# Altium project RocketPayloadV1.PrjPcb (part 1 of 2)
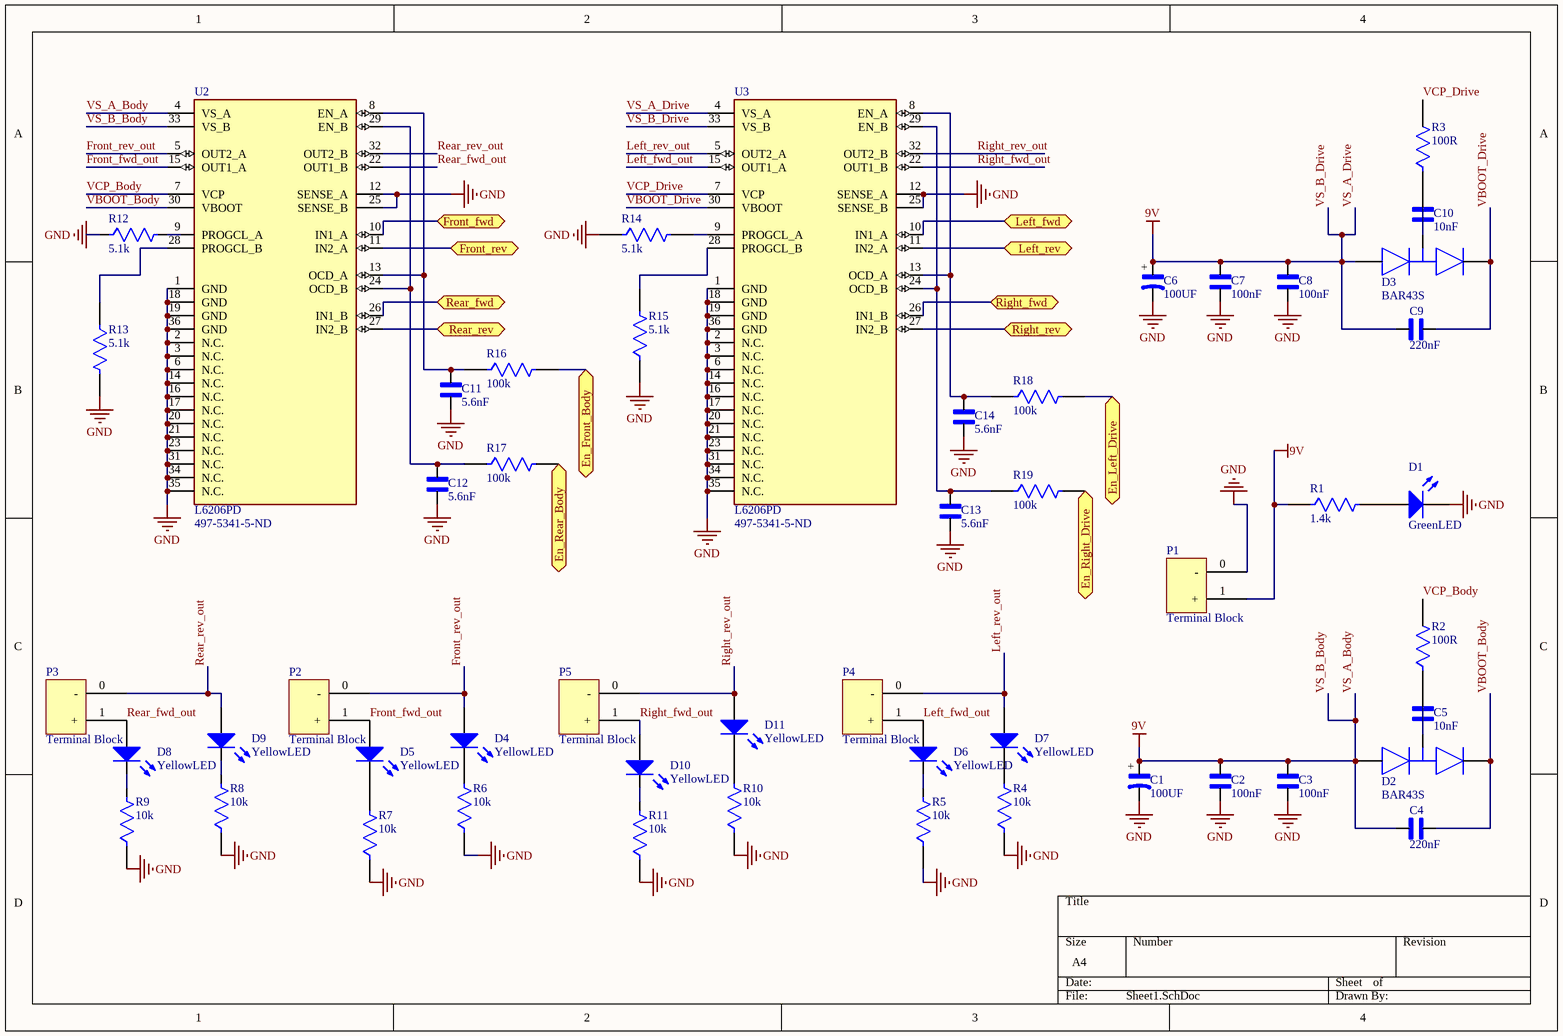
[diagram p0: Sheet1.SchDoc]
2 sheets, 77 parts. Net scope: flat (ports and power ports of the same name join across sheets).
Board file: PCB1.PcbDoc
Sheets:
  Sheet1.SchDoc
  Sheet2.SchDoc

## Sheet Sheet1.SchDoc
size A4

### Parts
C1  100UF  [100UF]
C2  100nF  [0402 Capacitor]
C3  100nF  [0402 Capacitor]
C4  220nF  [0805 Capacitor]
C5  10nF  [0402 Capacitor]
C6  100UF  [100UF]
C7  100nF  [0402 Capacitor]
C8  100nF  [0402 Capacitor]
C9  220nF  [0805 Capacitor]
C10  10nF  [0402 Capacitor]
C11  5.6nF  [0402 Capacitor]
C12  5.6nF  [0402 Capacitor]
C13  5.6nF  [0402 Capacitor]
C14  5.6nF  [0402 Capacitor]
D1  GreenLED  [LED]
D2  BAR43S  [Double Diode]
D3  BAR43S  [Double Diode]
D4  YellowLED  [LED]
D5  YellowLED  [LED]
D6  YellowLED  [LED]
D7  YellowLED  [LED]
D8  YellowLED  [LED]
D9  YellowLED  [LED]
D10  YellowLED  [LED]
D11  YellowLED  [LED]
P1  Terminal Block  [PHOENIX_1935161]
P2  Terminal Block  [PHOENIX_1935161]
P3  Terminal Block  [PHOENIX_1935161]
P4  Terminal Block  [PHOENIX_1935161]
P5  Terminal Block  [PHOENIX_1935161]
R1  1.4k  [0402 Resistor]
R2  100R  [0805 Resistor]
R3  100R  [0805 Resistor]
R4  10k  [0402 Resistor]
R5  10k  [0402 Resistor]
R6  10k  [0402 Resistor]
R7  10k  [0402 Resistor]
R8  10k  [0402 Resistor]
R9  10k  [0402 Resistor]
R10  10k  [0402 Resistor]
R11  10k  [0402 Resistor]
R12  5.1k  [0402 Resistor]
R13  5.1k  [0402 Resistor]
R14  5.1k  [0402 Resistor]
R15  5.1k  [0402 Resistor]
R16  100k  [0805 Resistor]
R17  100k  [0805 Resistor]
R18  100k  [0805 Resistor]
R19  100k  [0805 Resistor]
U2  L6206PD  Supplier Part Number 1: 497-5341-5-ND  [L6206PD]
U3  L6206PD  Supplier Part Number 1: 497-5341-5-ND  [L6206PD]

### Ports
En_Front_Body (bidir), En_Left_Drive (bidir), En_Rear_Body (bidir), En_Right_Drive (bidir), Front_fwd (bidir), Front_rev (bidir), Left_fwd (bidir), Left_rev (bidir), Rear_fwd (bidir), Rear_rev (bidir), Right_fwd (bidir), Right_rev (bidir)

### Nets
GND: C1.1 C2.1 C3.1 C6.1 C7.1 C8.1 C11.1 C12.1 C13.1 C14.1 D1.2(K) P1.0(-) R4.1 R5.1 R6.1 R7.1 R8.1 R9.1 R10.1 R11.1 R12.1 R13.2 R14.1 R15.1 U2.1(GND) U2.2(N.C.) U2.3(N.C.) U2.6(N.C.) U2.12(SENSE_A) U2.14(N.C.) U2.16(N.C.) U2.17(N.C.) U2.18(GND) U2.19(GND) U2.20(N.C.) U2.21(N.C.) U2.23(N.C.) U2.25(SENSE_B) U2.31(N.C.) U2.34(N.C.) U2.35(N.C.) U2.36(GND) U3.1(GND) U3.2(N.C.) U3.3(N.C.) U3.6(N.C.) U3.12(SENSE_A) U3.14(N.C.) U3.16(N.C.) U3.17(N.C.) U3.18(GND) U3.19(GND) U3.20(N.C.) U3.21(N.C.) U3.23(N.C.) U3.25(SENSE_B) U3.31(N.C.) U3.34(N.C.) U3.35(N.C.) U3.36(GND)
VS_A_Body: C1.+ C2.2 C3.2 C4.1 C6.+ C7.2 C8.2 C9.1 D2.1(A2) D3.1(A2) P1.1(+) R1.1 U2.4(VS_A) U2.33(VS_B) U3.4(VS_A) U3.33(VS_B)  [also labelled 9V, VS_A_Drive, VS_B_Body, VS_B_Drive]
Front_fwd_out: D5.1(A) P2.1(+) U2.15(OUT1_A)
Front_rev_out: D4.1(A) P2.0(-) U2.5(OUT2_A)
Left_fwd_out: D6.1(A) P4.1(+) U3.15(OUT1_A)
Left_rev_out: D7.1(A) P4.0(-) U3.5(OUT2_A)
Rear_fwd_out: D8.1(A) P3.1(+) U2.22(OUT1_B)
Rear_rev_out: D9.1(A) P3.0(-) U2.32(OUT2_B)
Right_fwd_out: D10.1(A) P5.1(+) U3.22(OUT1_B)
Right_rev_out: D11.1(A) P5.0(-) U3.32(OUT2_B)
VBOOT_Body: C4.2 D2.2(K1) U2.30(VBOOT)
VBOOT_Drive: C9.2 D3.2(K1) U3.30(VBOOT)
VCP_Body: R2.2 U2.7(VCP)
VCP_Drive: R3.2 U3.7(VCP)
NetC5_1: C5.1 D2.3
NetC5_2: C5.2 R2.1
NetC10_1: C10.1 D3.3
NetC10_2: C10.2 R3.1
NetC11_2: C11.2 R16.1 U2.8(EN_A) U2.13(OCD_A)
NetC12_2: C12.2 R17.1 U2.24(OCD_B) U2.29(EN_B)
NetC13_2: C13.2 R19.1 U3.24(OCD_B) U3.29(EN_B)
NetC14_2: C14.2 R18.1 U3.8(EN_A) U3.13(OCD_A)
NetD1_1: D1.1(A) R1.2
NetD5_2: D5.2(K) R7.2
NetD6_2: D6.2(K) R5.2
NetD8_2: D8.2(K) R9.2
NetD9_2: D9.2(K) R8.2
NetD10_2: D10.2(K) R11.2
NetD11_2: D11.2(K) R10.2
NetR12_2: R12.2 U2.9(PROGCL_A)
NetR13_1: R13.1 U2.28(PROGCL_B)
NetR14_2: R14.2 U3.9(PROGCL_A)
NetR15_2: R15.2 U3.28(PROGCL_B)
NetR16_2: R16.2 ; port En_Front_Body
NetR17_2: R17.2 ; port En_Rear_Body
NetR18_2: R18.2 ; port En_Left_Drive
NetR19_2: R19.2 ; port En_Right_Drive
NetU1_14: U2.26(IN1_B) ; port Rear_fwd
NetU1_15: U2.27(IN2_B) ; port Rear_rev
NetU1_52: U3.26(IN1_B) ; port Right_fwd
NetU1_53: U3.27(IN2_B) ; port Right_rev
NetU1_57: U2.11(IN2_A) ; port Front_rev
NetU1_58: U3.10(IN1_A) ; port Left_fwd
NetU1_59: U3.11(IN2_A) ; port Left_rev
NetU1_62: U2.10(IN1_A) ; port Front_fwd

Not connected (* = marked no-connect by the designer): D4 2(K); D7 2(K); R4 2; R6 2

### Library data of the parts
C1 C6 = 100UF Capacitor: Nichicon Aluminium Electrolytic Capacitor 100F 63 V 10mm Through Hole series VZ lifetime 1000h; Manufacturer Part Number: UVZ1J101MPD1TD; Voltage Rating (DC): 63V; Ripple Current: 215mA; Tolerance: 20%; Leakage Current: 189uA; Life (Hours): 1000Hour; Lead/Base Style: Straight; Dissipation Factor: 0.1%; Lead Diameter: 0.6mm; Supplier 1: Digi-Key; Manufacturer: Nichicon; RoHS: Yes; Category: Aluminum Electrolytic Capacitors; Stock 1: 4350; Pricing 1: 1=0.42000, 10=0.29000, 100=0.17420 (USD); Mount: Through Hole,PCB; Case/Package: Radial; Min Operating Temperature: -55°C; Max Operating Temperature: 105°C; Capacitance: 100uF; Voltage Rating: 63V; Termination: Radial; Package Quantity: 500; Packaging: Tape and Reel; Voltage: 63V; Diameter: 10mm; Length: 12.5mm; Height: 12.5mm; Lead Pitch: 5mm; Height - Seated (Max): 0.551inch; Lead Free: Lead Free; REACH SVHC: No SVHC; ComponentLink1URL: https://datasheet.ciiva.com/46393/1909357-46393465.pdf?src-supplier=Element14; ComponentLink1Description: https://datasheet.ciiva.com/46393/1909357-46393465.pdf?src-supplier=Element14; ComponentLink2URL: https://datasheet.ciiva.com/7907/e-vz-7907564.pdf?src-supplier=Element14; ComponentLink2Description: https://datasheet.ciiva.com/7907/e-vz-7907564.pdf?src-supplier=Element14; ComponentLink3URL: https://datasheet.ciiva.com/29546/e-vz-29546636.pdf?src-supplier=Digi-Key; ComponentLink3Description: https://datasheet.ciiva.com/29546/e-vz-29546636.pdf?src-supplier=Digi-Key; ComponentLink4URL: https://datasheet.ciiva.com/29546/e-vz-29546635.pdf?src-supplier=Digi-Key; ComponentLink4Description: https://datasheet.ciiva.com/29546/e-vz-29546635.pdf?src-supplier=Digi-Key; Supplier Part Number 1: 493-13479-1-ND
C2 C3 C7 C8 = 100nF Capacitor: CAP CER 0.1UF 16V X7R 0402; Manufacturer: Murata; Manufacturer Part Number: GRM155R71C104KA88J; Tolerance: 10%; Supplier 1: Digi-Key; RoHS: Yes; Category: Ceramic Capacitors; Stock 1: 24888178; Pricing 1: 1=0.10000, 10=0.03800, 100=0.01680, 500=0.01198, 1000=0.00941, 2500=0.00855, 5000=0.00787 (USD); Mount: Surface Mount; Case/Package: 0402; Case Code (Metric): 1005; Case Code (Imperial): 0402; Min Operating Temperature: -55°C; Max Operating Temperature: 125°C; Package Quantity: 1; Capacitance: 100nF; Voltage Rating: 16V; Packaging: Tape and Reel; Dielectric: X7R; Voltage Rating (DC): 16V; Termination: SMD/SMT; Voltage: 16V; Length: 1mm; Height: 0.5mm; Width: 0.02inch; Thickness: 0.022inch; Depth: 0.5mm; Radiation Hardening: No; REACH SVHC: No SVHC; Lead Free: Lead Free; ComponentLink1URL: https://datasheet.ciiva.com/6271/product-6271168.pdf?src-supplier=Digi-Key; ComponentLink1Description: https://datasheet.ciiva.com/6271/product-6271168.pdf?src-supplier=Digi-Key; ComponentLink2URL: https://datasheet.ciiva.com/6271/grm155r71c104ka88-01-6271231.pdf?src-supplier=Digi-Key; ComponentLink2Description: https://datasheet.ciiva.com/6271/grm155r71c104ka88-01-6271231.pdf?src-supplier=Digi-Key; Supplier Part Number 1: 490-6328-1-ND
C4 C9 = 220nF Capacitor: CAP CER 0805 220NF 100V X7R; Manufacturer: KEMET; Manufacturer Part Number: C0805C224K1RECAUTO; Tolerance: 10%; Supplier 1: Digi-Key; RoHS: No; Category: Ceramic Capacitors; Stock 1: 6983; Pricing 1: 1=0.30000, 10=0.20400, 100=0.11580, 500=0.08172, 1000=0.07151 (USD); Mount: Surface Mount; Case/Package: 0805; Min Operating Temperature: -55°C; Max Operating Temperature: 125°C; Packaging: Cut Tape; Capacitance: 220nF; Voltage Rating: 100V; Ratings: AEC-Q200; ComponentLink1URL: https://api.kemet.com/component-edge/download/datasheet/C0805C224K1RECAUTO.pdf?src-supplier=Digi-Key; ComponentLink1Description: https://api.kemet.com/component-edge/download/datasheet/C0805C224K1RECAUTO.pdf?src-supplier=Digi-Key; Supplier Part Number 1: 399-17890-1-ND
C5 C10 = 10nF Capacitor: CAP CER 10000PF 50V X7R 0402; Manufacturer: KEMET; Manufacturer Part Number: C0402C103M5RACTU; Dielectric Material: Ceramic; Tolerance: 20%; Dissipation Factor: 2.5%; Supplier 1: Digi-Key; RoHS: Yes; Category: Ceramic Capacitors; Stock 1: 104917; Pricing 1: 1=0.10000, 10=0.02200, 100=0.00990, 500=0.00708, 1000=0.00557, 2500=0.00506, 5000=0.00466 (USD); Mount: Surface Mount; Case/Package: 0402; Case Code (Metric): 1005; Case Code (Imperial): 0402; Min Operating Temperature: -55°C; Max Operating Temperature: 125°C; Capacitance: 10nF; Voltage Rating: 50V; Packaging: Tape and Reel; Package Quantity: 10000; Voltage Rating (DC): 50V; Dielectric: X7R; Termination: SMD/SMT; Length: 1mm; Height: 0.5mm; Width: 0.02inch; Thickness: 0.022inch; Lead Pitch: 0.3mm; Depth: 0.5mm; Radiation Hardening: No; ComponentLink1URL: https://datasheet.ciiva.com/18192/getdatasheetpartid-439437-18192407.pdf?src-supplier=Verical; ComponentLink1Description: https://datasheet.ciiva.com/18192/getdatasheetpartid-439437-18192407.pdf?src-supplier=Verical; ComponentLink2URL: https://datasheet.ciiva.com/5414/kem-c1002-x7r-smd-5414682.pdf?src-supplier=Mouser; ComponentLink2Description: https://datasheet.ciiva.com/5414/kem-c1002-x7r-smd-5414682.pdf?src-supplier=Mouser; Supplier Part Number 1: 399-7760-1-ND
C11-C14 = 5.6nF Capacitor: CAP CER 5600PF 25V X7R 0402; Manufacturer: Yageo; Manufacturer Part Number: CC0402KRX7R8BB562; Tolerance: 10%; Supplier 1: Digi-Key; RoHS: Yes; Category: Ceramic Capacitors; Stock 1: 20030; Pricing 1: 1=0.10000, 10=0.03600, 100=0.01620, 500=0.01156, 1000=0.00908, 2500=0.00825, 5000=0.00759 (USD); Mount: Surface Mount; Case/Package: 0402; Number of Pins: 2; Weight: 2.3E-05oz; Case Code (Imperial): 0402; Case Code (Metric): 1005; Min Operating Temperature: -55°C; Max Operating Temperature: 125°C; Voltage Rating: 25V; Capacitance: 5.6nF; Packaging: Tape and Reel; Voltage Rating (DC): 25V; Dielectric: X7R; Termination: SMD/SMT; Composition: Ceramic; Length: 0.039inch; Width: 0.02inch; Thickness: 0.022inch; Depth: 0.5mm; Lead Free: Lead Free; Halogen Free: Halogen Free; ComponentLink1URL: https://datasheet.ciiva.com/13264/upy-gphc-x7r-6-3v-to-50v-8-12304-13264955.pdf?src-supplier=Mouser; ComponentLink1Description: https://datasheet.ciiva.com/13264/upy-gphc-x7r-6-3v-to-50v-8-12304-13264955.pdf?src-supplier=Mouser; Supplier Part Number 1: 311-1718-1-ND
D1 = GreenLED: LED GREEN CLEAR SMD; Manufacturer: Lumex; Manufacturer Part Number: SML-LXFP0603SUGCTR; Lens Color: Colorless; Power Rating: 30mW; Reverse Voltage (DC): 5V; Wavelength: 574nm; Test Current: 5mA; Forward Voltage: 2V; Luminous Intensity: 13mcd; Viewing Angle: 130°; Lens Style: Rectangular; Supplier 1: Digi-Key; RoHS: Yes; Category: LEDs; Stock 1: 9865; Pricing 1: 1=0.43000, 10=0.30000, 100=0.17500, 500=0.12000, 1000=0.10000 (USD); Mount: Surface Mount; Case/Package: 0603; Case Code (Imperial): 0603; Color: Green; Case Code (Metric): 1608; Min Operating Temperature: -40°C; Max Operating Temperature: 85°C; Lens Transparency: Clear; Illumination Color: Green; Forward Current: 5mA; Packaging: Tape and Reel; Package Quantity: 3000; Length: 1.6mm; Height: 0.2mm; Width: 0.8mm; ComponentLink1URL: https://datasheet.ciiva.com/24152/sml-lxfp0603sugctr-272463-24152468.pdf?src-supplier=Mouser; ComponentLink1Description: https://datasheet.ciiva.com/24152/sml-lxfp0603sugctr-272463-24152468.pdf?src-supplier=Mouser; ComponentLink2URL: https://datasheet.ciiva.com/29559/sml-lxfp0603sugctr-29559740.pdf?src-supplier=Digi-Key; ComponentLink2Description: https://datasheet.ciiva.com/29559/sml-lxfp0603sugctr-29559740.pdf?src-supplier=Digi-Key; Supplier Part Number 1: 67-2222-1-ND
D2 D3 = Diode Series: STMICROELECTRONICS - BAR43SFILM - Small Signal Schottky Diode, Dual Series, 30 V, 100 mA, 330 mV, 750 mA, 150 C RoHS Compliant: Yes; Max Surge Current: 750mA; Forward Voltage: 1V; Forward Current: 100mA; Peak Reverse Current: 500nA; Recovery Time: 5ns; Max Repetitive Reverse Voltage (Vrrm): 30V; Power Dissipation: 250mW; Capacitance: 7pF; Supplier 1: Digi-Key; Manufacturer: STMicroelectronics; Manufacturer Part Number: BAR43SFILM; RoHS: Yes; Category: Rectifier Diodes; Stock 1: 25965; Pricing 1: 1=0.37000, 10=0.29900, 25=0.25040, 100=0.12230, 250=0.12036, 500=0.10202, 1000=0.07089 (USD); Mount: Surface Mount; Case/Package: SOT-23; Number of Pins: 3; Weight: 0.01lb; Min Operating Temperature: -65°C; Max Operating Temperature: 150°C; Packaging: Tape and Reel; Package Quantity: 3000; Max Reverse Leakage Current: 500nA; Average Rectified Current: 100mA; Reverse Recovery Time: 5ns; Peak Non-Repetitive Surge Current: 750mA; Max Forward Surge Current (Ifsm): 750mA; Termination: SMD/SMT; Element Configuration: Dual; Current Rating: 100mA; Voltage Rating (DC): 30V; Max Reverse Voltage (DC): 30V; Length: 2.9mm; Height: 0.95mm; Width: 3.05mm; Radiation Hardening: No; REACH SVHC: No SVHC; Lead Free: Lead Free; ComponentLink1URL: https://datasheet.ciiva.com/1177/1700360-1177600.pdf?src-supplier=Element14; ComponentLink1Description: https://datasheet.ciiva.com/1177/1700360-1177600.pdf?src-supplier=Element14; ComponentLink2URL: https://datasheet.ciiva.com/4714/cd00000764-105363-4714418.pdf?src-supplier=Mouser; ComponentLink2Description: https://datasheet.ciiva.com/4714/cd00000764-105363-4714418.pdf?src-supplier=Mouser; ComponentLink3URL: https://datasheet.ciiva.com/34301/924342-34301780.pdf?src-supplier=Jameco; ComponentLink3Description: https://datasheet.ciiva.com/34301/924342-34301780.pdf?src-supplier=Jameco; ComponentLink4URL: https://datasheet.ciiva.com/905/cd00000764-905875.pdf?src-supplier=Digi-Key; ComponentLink4Description: https://datasheet.ciiva.com/905/cd00000764-905875.pdf?src-supplier=Digi-Key; ComponentLink5URL: https://datasheet.ciiva.com/905/cd00000764-905876.pdf?src-supplier=Digi-Key; ComponentLink5Description: https://datasheet.ciiva.com/905/cd00000764-905876.pdf?src-supplier=Digi-Key; ComponentLink6URL: https://datasheet.ciiva.com/905/cd00000764-905877.pdf?src-supplier=Digi-Key; ComponentLink6Description: https://datasheet.ciiva.com/905/cd00000764-905877.pdf?src-supplier=Digi-Key; ComponentLink7URL: https://datasheet.ciiva.com/7964/1700360-7964102.pdf?src-supplier=Element14; ComponentLink7Description: https://datasheet.ciiva.com/7964/1700360-7964102.pdf?src-supplier=Element14; ComponentLink8URL: https://datasheet.ciiva.com/1200/1700360-1200008.pdf?src-supplier=Farnell; ComponentLink8Description: https://datasheet.ciiva.com/1200/1700360-1200008.pdf?src-supplier=Farnell; ComponentLink9URL: https://datasheet.ciiva.com/1199/1700360-1199962.pdf?src-supplier=Farnell; ComponentLink9Description: https://datasheet.ciiva.com/1199/1700360-1199962.pdf?src-supplier=Farnell; ComponentLink10URL: https://datasheet.ciiva.com/15144/getdatasheetpartid-39351-15144075.pdf?src-supplier=Verical; ComponentLink10Description: https://datasheet.ciiva.com/15144/getdatasheetpartid-39351-15144075.pdf?src-supplier=Verical; ComponentLink11URL: https://datasheet.ciiva.com/16226/cd00000764-16226780.pdf?src-supplier=Future+Electronics; ComponentLink11Description: https://datasheet.ciiva.com/16226/cd00000764-16226780.pdf?src-supplier=Future+Electronics; ComponentLink12URL: https://datasheet.ciiva.com/27746/47-2902e-27746700.pdf?src-supplier=Rapid+Electronics; ComponentLink12Description: https://datasheet.ciiva.com/27746/47-2902e-27746700.pdf?src-supplier=Rapid+Electronics; Supplier Part Number 1: 497-2515-1-ND
D4-D11 = YellowLED: Led Yellow Clear 0603 SMD; Manufacturer: Inolux; Manufacturer Part Number: IN-S63AT5Y; Lens Style: Flat; Luminous Intensity: 23mcd; Forward Voltage: 2V; Test Current: 5mA; Viewing Angle: 120°; Dominant Wavelength: 589nm; Lens Size: 0.8mm; Supplier 1: Digi-Key; RoHS: No; Category: LEDs; Stock 1: 6149; Pricing 1: 1=0.32000, 10=0.23200, 100=0.10970, 500=0.07314, 1000=0.05729 (USD); Mount: Surface Mount; Case/Package: 0603; Color: Yellow; Lens Color: Clear; Case Code (Imperial): 0603; Case Code (Metric): 1608; Packaging: Tape and Reel; Lens Transparency: Clear; Length: 1.6mm; Height: 0.39mm; Width: 0.8mm; ComponentLink1URL: http://www.inolux-corp.com/datasheet/SMDLED/Mono%20Color%20Top%20View/IN-S63AT%20Series_V1.1.pdf?src-supplier=Digi-Key; ComponentLink1Description: http://www.inolux-corp.com/datasheet/SMDLED/Mono%20Color%20Top%20View/IN-S63AT%20Series_V1.1.pdf?src-supplier=Digi-Key; Supplier Part Number 1: 1830-1066-1-ND
P1-P5 = 1935161: Conn Terminal Blocks 2 POS 5mm Solder ST Thru-Hole 16A; Manufacturer: Phoenix Contact; Connector Type: Screw; Voltage Rating (DC): 320V; Max Supply Voltage: 250V; Current Rating: 17.5A; Number of Poles: 2; Number of Levels: 1; Current: 18A; Voltage: 300V; Wire Gauge (Max): 26AWG; Wire Gauge (Min): 12AWG; Approvals: UL; Supplier 1: Digi-Key; Manufacturer Part Number: 1935161; RoHS: Yes; Category: Terminal Blocks; Stock 1: 54304; Pricing 1: 1=0.43000, 10=0.41100, 50=0.39280, 100=0.38200, 250=0.35700, 500=0.32844, 1000=0.30350 (USD); Mount: Through Hole; Number of Pins: 2; Weight: 0.067021oz; Contact Material: Copper,Tin; Insulation Material: Nylon; Housing Material: Polyamide; Housing Color: Green; Color: Green; Material: Nylon; Number of Rows: 1; Max Current Rating: 16A; Voltage Rating: 250V; Package Quantity: 250; Packaging: Bulk; Number of Positions: 2; Number of Positions Per Level: 2; Termination: Solder; Number of Contacts: 2; Number of Circuits: 2; Orientation: Straight; Length: 9mm; Height: 11.3mm; Width: 14.9mm; Pitch: 5mm; Depth: 9mm; Wire/Cable Gauge: 26AWG; Radiation Hardening: No; Flammability Rating: UL94 V-0; Lead Free: Lead Free; REACH SVHC: Unknown; ComponentLink1URL: https://datasheet.ciiva.com/15169/getdatasheetpartid-177903-15169663.pdf?src-supplier=Verical; ComponentLink1Description: https://datasheet.ciiva.com/15169/getdatasheetpartid-177903-15169663.pdf?src-supplier=Verical; ComponentLink2URL: https://datasheet.ciiva.com/16047/1935161-16047247.pdf?src-supplier=Onlinecomponents.com; ComponentLink2Description: https://datasheet.ciiva.com/16047/1935161-16047247.pdf?src-supplier=Onlinecomponents.com; ComponentLink3URL: https://datasheet.ciiva.com/824/combiconcompact5-0mmseries-824222.pdf?src-supplier=Digi-Key; ComponentLink3Description: https://datasheet.ciiva.com/824/combiconcompact5-0mmseries-824222.pdf?src-supplier=Digi-Key; Supplier Part Number 1: 277-1667-ND
R1 = 1.4k Resistor: RES SMD 14K OHM 0.1% 1/16W 0402; Manufacturer: Panasonic; Manufacturer Part Number: ERA-2AEB1402X; Resistance: 14kR; Power Rating: 63mW; Voltage Rating: 25V; Temperature Coefficient: 25ppm/°C; Voltage Rating (DC): 50V; Supplier 1: Digi-Key; RoHS: Yes; Category: Chip SMD Resistors; Stock 1: 3069; Pricing 1: 1=0.43000, 10=0.30500, 100=0.12220, 1000=0.06021, 2500=0.05579, 5000=0.05047 (USD); Mount: Surface Mount; Case/Package: 0402; Case Code (Metric): 1005; Case Code (Imperial): 0402; Contact Plating: Tin; Min Operating Temperature: -55°C; Max Operating Temperature: 155°C; Package Quantity: 10000; Packaging: Tape and Reel; Tolerance: 0.1%; Composition: Metal Film,Thin Film; Number of Terminations: 2; Max Power Dissipation: 63mW; Termination: SMD/SMT; Length: 0.039inch; Height: 0.016inch; Width: 0.5mm; Radiation Hardening: No; REACH SVHC: Unknown; Lead Free: Lead Free; ComponentLink1URL: https://datasheet.ciiva.com/9193/aoa0000ce26-9193279.pdf?src-supplier=Avnet; ComponentLink1Description: https://datasheet.ciiva.com/9193/aoa0000ce26-9193279.pdf?src-supplier=Avnet; Supplier Part Number 1: P14KDCCT-ND
R2 R3 = 100R Resistor: RESISTOR, SURGE, 0805, 1%, 100R; Manufacturer: Panasonic; Manufacturer Part Number: ERJ-P06F1000V; Power Rating: 500mW; Voltage Rating: 150V; Temperature Coefficient: 100ppm/°C; Supplier 1: Digi-Key; RoHS: Yes; Category: Chip SMD Resistors; Stock 1: 401308; Pricing 1: 1=0.17000, 10=0.14800, 100=0.05770, 1000=0.02416, 2500=0.02214 (USD); Mount: Surface Mount; Case/Package: 0805; Number of Pins: 2; Contact Plating: Tin; Case Code (Imperial): 0805; Case Code (Metric): 2012; Min Operating Temperature: -55°C; Max Operating Temperature: 155°C; Resistance: 100R; Tolerance: 1%; Packaging: Tape and Reel; Package Quantity: 5000; Termination: SMD/SMT; Military Standard: Not; Composition: Thick Film; Voltage Rating (DC): 150V; Length: 2mm; Height: 0.6mm; Width: 1.2mm; Depth: 1.25mm; Radiation Hardening: No; REACH SVHC: No SVHC; ComponentLink1URL: https://datasheet.ciiva.com/11817/0900766b812cb812-11817182.pdf?src-supplier=RSComponents; ComponentLink1Description: https://datasheet.ciiva.com/11817/0900766b812cb812-11817182.pdf?src-supplier=RSComponents; ComponentLink2URL: https://datasheet.ciiva.com/24070/aoa0000ce4-64075-24070038.pdf?src-supplier=Mouser; ComponentLink2Description: https://datasheet.ciiva.com/24070/aoa0000ce4-64075-24070038.pdf?src-supplier=Mouser; ComponentLink3URL: https://datasheet.ciiva.com/17208/aoa0000ce4-17208007.pdf?src-supplier=Avnet+Europe; ComponentLink3Description: https://datasheet.ciiva.com/17208/aoa0000ce4-17208007.pdf?src-supplier=Avnet+Europe; ComponentLink4URL: https://datasheet.ciiva.com/30103/aoa0000ce4-30103141.pdf?src-supplier=Onlinecomponents.com; ComponentLink4Description: https://datasheet.ciiva.com/30103/aoa0000ce4-30103141.pdf?src-supplier=Onlinecomponents.com; ComponentLink5URL: https://datasheet.ciiva.com/48426/erjp-series-eng-tds-48426777.pdf?src-supplier=Distrelec; ComponentLink5Description: https://datasheet.ciiva.com/48426/erjp-series-eng-tds-48426777.pdf?src-supplier=Distrelec; ComponentLink6URL: https://datasheet.ciiva.com/9186/aoa0000ce4-9186922.pdf?src-supplier=Avnet; ComponentLink6Description: https://datasheet.ciiva.com/9186/aoa0000ce4-9186922.pdf?src-supplier=Avnet; ComponentLink7URL: https://datasheet.ciiva.com/22758/1801181-22758282.pdf?src-supplier=Farnell; ComponentLink7Description: https://datasheet.ciiva.com/22758/1801181-22758282.pdf?src-supplier=Farnell; ComponentLink8URL: https://datasheet.ciiva.com/22758/1801181-22758283.pdf?src-supplier=Farnell; ComponentLink8Description: https://datasheet.ciiva.com/22758/1801181-22758283.pdf?src-supplier=Farnell; ComponentLink9URL: https://datasheet.ciiva.com/7830/1790600-7830815.pdf?src-supplier=Element14; ComponentLink9Description: https://datasheet.ciiva.com/7830/1790600-7830815.pdf?src-supplier=Element14; Supplier Part Number 1: P16057CT-ND
R4-R11 = 10k Resistor: Res Thin Film 0402 10K Ohm 0.5% 0.063W(1/16W) ±25ppm/C Molded SMD Automotive Punched T/R; Manufacturer: Panasonic; Manufacturer Part Number: ERA-2AED103X; Power Rating: 63mW; Voltage Rating: 25V; Resistance: 10kR; Temperature Coefficient: 25ppm/°C; Supplier 1: Digi-Key; RoHS: Yes; Category: Chip SMD Resistors; Stock 1: 133108; Pricing 1: 1=0.21000, 10=0.17900, 100=0.07000, 1000=0.02930, 2500=0.02686, 5000=0.02442 (USD); Mount: Surface Mount; Case/Package: 0402; Weight: 2.8E-05oz; Case Code (Imperial): 0402; Case Code (Metric): 1005; Contact Plating: Tin; Min Operating Temperature: -55°C; Max Operating Temperature: 155°C; Tolerance: 0.5%; Packaging: Tape and Reel; Package Quantity: 10000; Termination: SMD/SMT; Composition: Metal Film,Thin Film; Number of Terminations: 2; Military Standard: Not; Max Power Dissipation: 63mW; Voltage Rating (DC): 25V; Length: 1mm; Height: 0.016inch; Width: 0.5mm; Depth: 0.5mm; REACH SVHC: No SVHC; Lead Free: Lead Free; ComponentLink1URL: https://datasheet.ciiva.com/30240/54aoa0000ce26-30240474.pdf?src-supplier=Onlinecomponents.com; ComponentLink1Description: https://datasheet.ciiva.com/30240/54aoa0000ce26-30240474.pdf?src-supplier=Onlinecomponents.com; ComponentLink2URL: https://datasheet.ciiva.com/46378/1776116-46378235.pdf?src-supplier=Element14; ComponentLink2Description: https://datasheet.ciiva.com/46378/1776116-46378235.pdf?src-supplier=Element14; ComponentLink3URL: https://datasheet.ciiva.com/7830/1776116-7830919.pdf?src-supplier=Element14; ComponentLink3Description: https://datasheet.ciiva.com/7830/1776116-7830919.pdf?src-supplier=Element14; ComponentLink4URL: https://datasheet.ciiva.com/43470/1776116-43470437.pdf?src-supplier=Farnell; ComponentLink4Description: https://datasheet.ciiva.com/43470/1776116-43470437.pdf?src-supplier=Farnell; Supplier Part Number 1: P10KDECT-ND
R12-R15 = 5.1k Resistor: PANASONIC - ERJ2RKF5101X - SMD Chip Resistor, 0402 [1005 Metric], 5.1 kohm, ERJ2R Series, 50 V, Thick Film, 100 mW; Manufacturer Part Number: ERJ-2RKF5101X; Resistance: 5.1kR; Tolerance: 1%; Power Rating: 100mW; Voltage Rating: 50V; Temperature Coefficient: 100ppm/°C; Supplier 1: Digi-Key; Manufacturer: Panasonic; RoHS: Yes; Category: Chip SMD Resistors; Stock 1: 1276231; Pricing 1: 1=0.10000, 10=0.04300, 100=0.01750, 1000=0.00787, 2500=0.00683, 5000=0.00564 (USD); Mount: Surface Mount; Case/Package: 0402; Weight: 2.8E-05oz; Case Code (Imperial): 0402; Case Code (Metric): 1005; Contact Plating: Tin; Min Operating Temperature: -55°C; Max Operating Temperature: 155°C; Packaging: Tape and Reel; Package Quantity: 10000; Composition: Thick Film; Termination: SMD/SMT; Number of Terminations: 2; Military Standard: Not; Max Power Dissipation: 100mW; Voltage Rating (DC): 50V; Length: 1mm; Height: 0.35mm; Width: 0.5mm; Depth: 0.5mm; REACH SVHC: No SVHC; Lead Free: Lead Free; ComponentLink1URL: https://datasheet.ciiva.com/11821/0900766b80f80784-11821351.pdf?src-supplier=RSComponents; ComponentLink1Description: https://datasheet.ciiva.com/11821/0900766b80f80784-11821351.pdf?src-supplier=RSComponents; ComponentLink2URL: https://datasheet.ciiva.com/16788/70260748-16788554.pdf?src-supplier=Allied+Electronics; ComponentLink2Description: https://datasheet.ciiva.com/16788/70260748-16788554.pdf?src-supplier=Allied+Electronics; ComponentLink3URL: https://datasheet.ciiva.com/16761/70260748-16761739.pdf?src-supplier=Allied+Electronics; ComponentLink3Description: https://datasheet.ciiva.com/16761/70260748-16761739.pdf?src-supplier=Allied+Electronics; ComponentLink4URL: https://datasheet.ciiva.com/9195/aoa0000ce2-9195580.pdf?src-supplier=Avnet; ComponentLink4Description: https://datasheet.ciiva.com/9195/aoa0000ce2-9195580.pdf?src-supplier=Avnet; ComponentLink5URL: https://datasheet.ciiva.com/43467/1678782-43467375.pdf?src-supplier=Farnell; ComponentLink5Description: https://datasheet.ciiva.com/43467/1678782-43467375.pdf?src-supplier=Farnell; Supplier Part Number 1: P5.10KLCT-ND
R16-R19 = 100k Resistor: YAGEO         RC0805FR-07100KL            RES, THICK FILM, 100K, 1%, 0.125W, 0805, REEL; Resistance: 100kR; Power Rating: 125mW; Temperature Coefficient: 100ppm/°C; Voltage Rating: 150V; Supplier 1: Digi-Key; Manufacturer: Yageo; Manufacturer Part Number: RC0805FR-07100KL; RoHS: Yes; Category: Chip SMD Resistors; Stock 1: 4441686; Pricing 1: 1=0.10000, 10=0.04000, 100=0.01630, 1000=0.00731, 2500=0.00635 (USD); Case/Package: 0805; Number of Pins: 2; Case Code (Metric): 2012; Case Code (Imperial): 0805; Min Operating Temperature: -55°C; Max Operating Temperature: 155°C; Tolerance: 1%; Packaging: Tape and Reel; Voltage Rating (DC): 150V; Package Quantity: 1; Composition: Thick Film; Number of Terminations: 2; Termination: SMD/SMT; Military Standard: Not; Max Power Dissipation: 125mW; Features: Moisture Resistant; Length: 2mm; Height: 0.024inch; Width: 0.049inch; Depth: 1.25mm; Lead Pitch: 0.4mm; REACH SVHC: Unknown; Lead Free: Lead Free; ComponentLink1URL: https://datasheet.ciiva.com/11808/0900766b8106beab-11808858.pdf?src-supplier=RSComponents; ComponentLink1Description: https://datasheet.ciiva.com/11808/0900766b8106beab-11808858.pdf?src-supplier=RSComponents; ComponentLink2URL: https://datasheet.ciiva.com/2457/pyu-r-int-thick-7-2457017.pdf?src-supplier=Digi-Key; ComponentLink2Description: https://datasheet.ciiva.com/2457/pyu-r-int-thick-7-2457017.pdf?src-supplier=Digi-Key; ComponentLink3URL: https://datasheet.ciiva.com/12667/rc0805-12667001.pdf?src-supplier=Mouser; ComponentLink3Description: https://datasheet.ciiva.com/12667/rc0805-12667001.pdf?src-supplier=Mouser; ComponentLink4URL: https://datasheet.ciiva.com/2457/pyu-r-int-thick-7-2457018.pdf?src-supplier=Digi-Key; ComponentLink4Description: https://datasheet.ciiva.com/2457/pyu-r-int-thick-7-2457018.pdf?src-supplier=Digi-Key; ComponentLink5URL: https://datasheet.ciiva.com/16747/rc0805-16747226.pdf?src-supplier=Future+Electronics; ComponentLink5Description: https://datasheet.ciiva.com/16747/rc0805-16747226.pdf?src-supplier=Future+Electronics; ComponentLink6URL: https://datasheet.ciiva.com/2457/pyu-r-int-thick-7-2457019.pdf?src-supplier=Digi-Key; ComponentLink6Description: https://datasheet.ciiva.com/2457/pyu-r-int-thick-7-2457019.pdf?src-supplier=Digi-Key; ComponentLink7URL: https://datasheet.ciiva.com/7660/38627-7660796.pdf?src-supplier=Element14; ComponentLink7Description: https://datasheet.ciiva.com/7660/38627-7660796.pdf?src-supplier=Element14; ComponentLink8URL: https://datasheet.ciiva.com/7941/1697719-7941676.pdf?src-supplier=Element14; ComponentLink8Description: https://datasheet.ciiva.com/7941/1697719-7941676.pdf?src-supplier=Element14; ComponentLink9URL: https://datasheet.ciiva.com/7941/1686128-7941677.pdf?src-supplier=Element14; ComponentLink9Description: https://datasheet.ciiva.com/7941/1686128-7941677.pdf?src-supplier=Element14; ComponentLink10URL: https://datasheet.ciiva.com/7941/1697719-7941678.pdf?src-supplier=Element14; ComponentLink10Description: https://datasheet.ciiva.com/7941/1697719-7941678.pdf?src-supplier=Element14; ComponentLink11URL: https://datasheet.ciiva.com/22747/444164-22747534.pdf?src-supplier=Element14; ComponentLink11Description: https://datasheet.ciiva.com/22747/444164-22747534.pdf?src-supplier=Element14; Supplier Part Number 1: 311-100KCRCT-ND
U2 U3 = L6206PD: Bridge Driver IC PowerSO-36, L6206PD, ST; Manufacturer: STMicroelectronics; Min Supply Voltage: 8V; Operating Supply Voltage: 48V; Max Supply Voltage: 52V; Number of Outputs: 4; Output Current: 2.8A; Max Output Current: 5.6A; On-State Resistance: 300mR; Operating Supply Current: 5mA; Rise Time: 250ns; Release Time: 550ns; Motor Type: Brushed; Supplier 1: Digi-Key; Manufacturer Part Number: L6206PD; RoHS: Yes; Category: Motor Drivers; Stock 1: 6312; Pricing 1: 1=6.49000, 10=5.85900, 25=5.58640, 100=4.63250, 250=4.22376, 500=3.95126, 1000=3.54250, 2500=3.40625, 5000=3.35175 (USD); Mount: Surface Mount; Case/Package: SOIC; Number of Pins: 36; Min Operating Temperature: -25°C; Max Operating Temperature: 125°C; Package Quantity: 31; Packaging: Rail/Tube; Output Voltage: 52V; Output Current per Channel: 2.8A; Max Collector Current: 2.8A; Collector Emitter Voltage (VCEO): 52V; Length: 16mm; Height: 3.3mm; Width: 11.1mm; Radiation Hardening: No; REACH SVHC: No SVHC; ComponentLink1URL: https://datasheet.ciiva.com/15109/getdatasheetpartid-189010-15109428.pdf?src-supplier=Verical; ComponentLink1Description: https://datasheet.ciiva.com/15109/getdatasheetpartid-189010-15109428.pdf?src-supplier=Verical; ComponentLink2URL: https://datasheet.ciiva.com/19477/1470178-19477478.pdf?src-supplier=Jameco; ComponentLink2Description: https://datasheet.ciiva.com/19477/1470178-19477478.pdf?src-supplier=Jameco; ComponentLink3URL: https://datasheet.ciiva.com/26880/l6206pd-26880436.pdf?src-supplier=IIIC; ComponentLink3Description: https://datasheet.ciiva.com/26880/l6206pd-26880436.pdf?src-supplier=IIIC; ComponentLink4URL: https://datasheet.ciiva.com/1957/cd00002346-1957105.pdf?src-supplier=Digi-Key; ComponentLink4Description: https://datasheet.ciiva.com/1957/cd00002346-1957105.pdf?src-supplier=Digi-Key; ComponentLink5URL: https://datasheet.ciiva.com/16370/cd00002346-16370975.pdf?src-supplier=Future+Electronics; ComponentLink5Description: https://datasheet.ciiva.com/16370/cd00002346-16370975.pdf?src-supplier=Future+Electronics